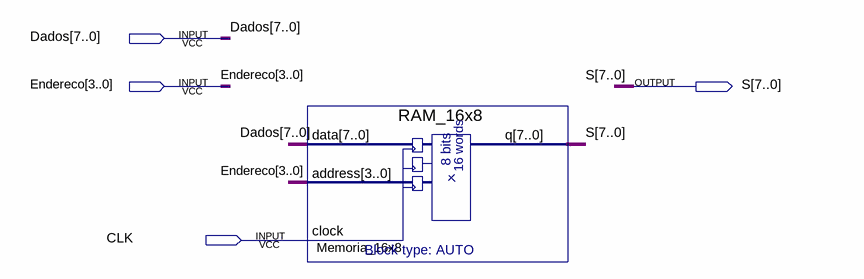
[diagram p0: schematic sheet]
// Quartus schematic Memoria_16x8.bdf as structural Verilog: 1 symbols, 4 pins
module Memoria_16x8 (
  input  [7:0] Dados,
  input  [3:0] Endereco,
  input  CLK,
  output [7:0] S
);

  RAM_16x8 Memoria_16x8 (.data(Dados), .address(Endereco), .clock(CLK), .q(S));
endmodule
